# EAGLE schematic PIC_WIFI (EAGLE 6.2)
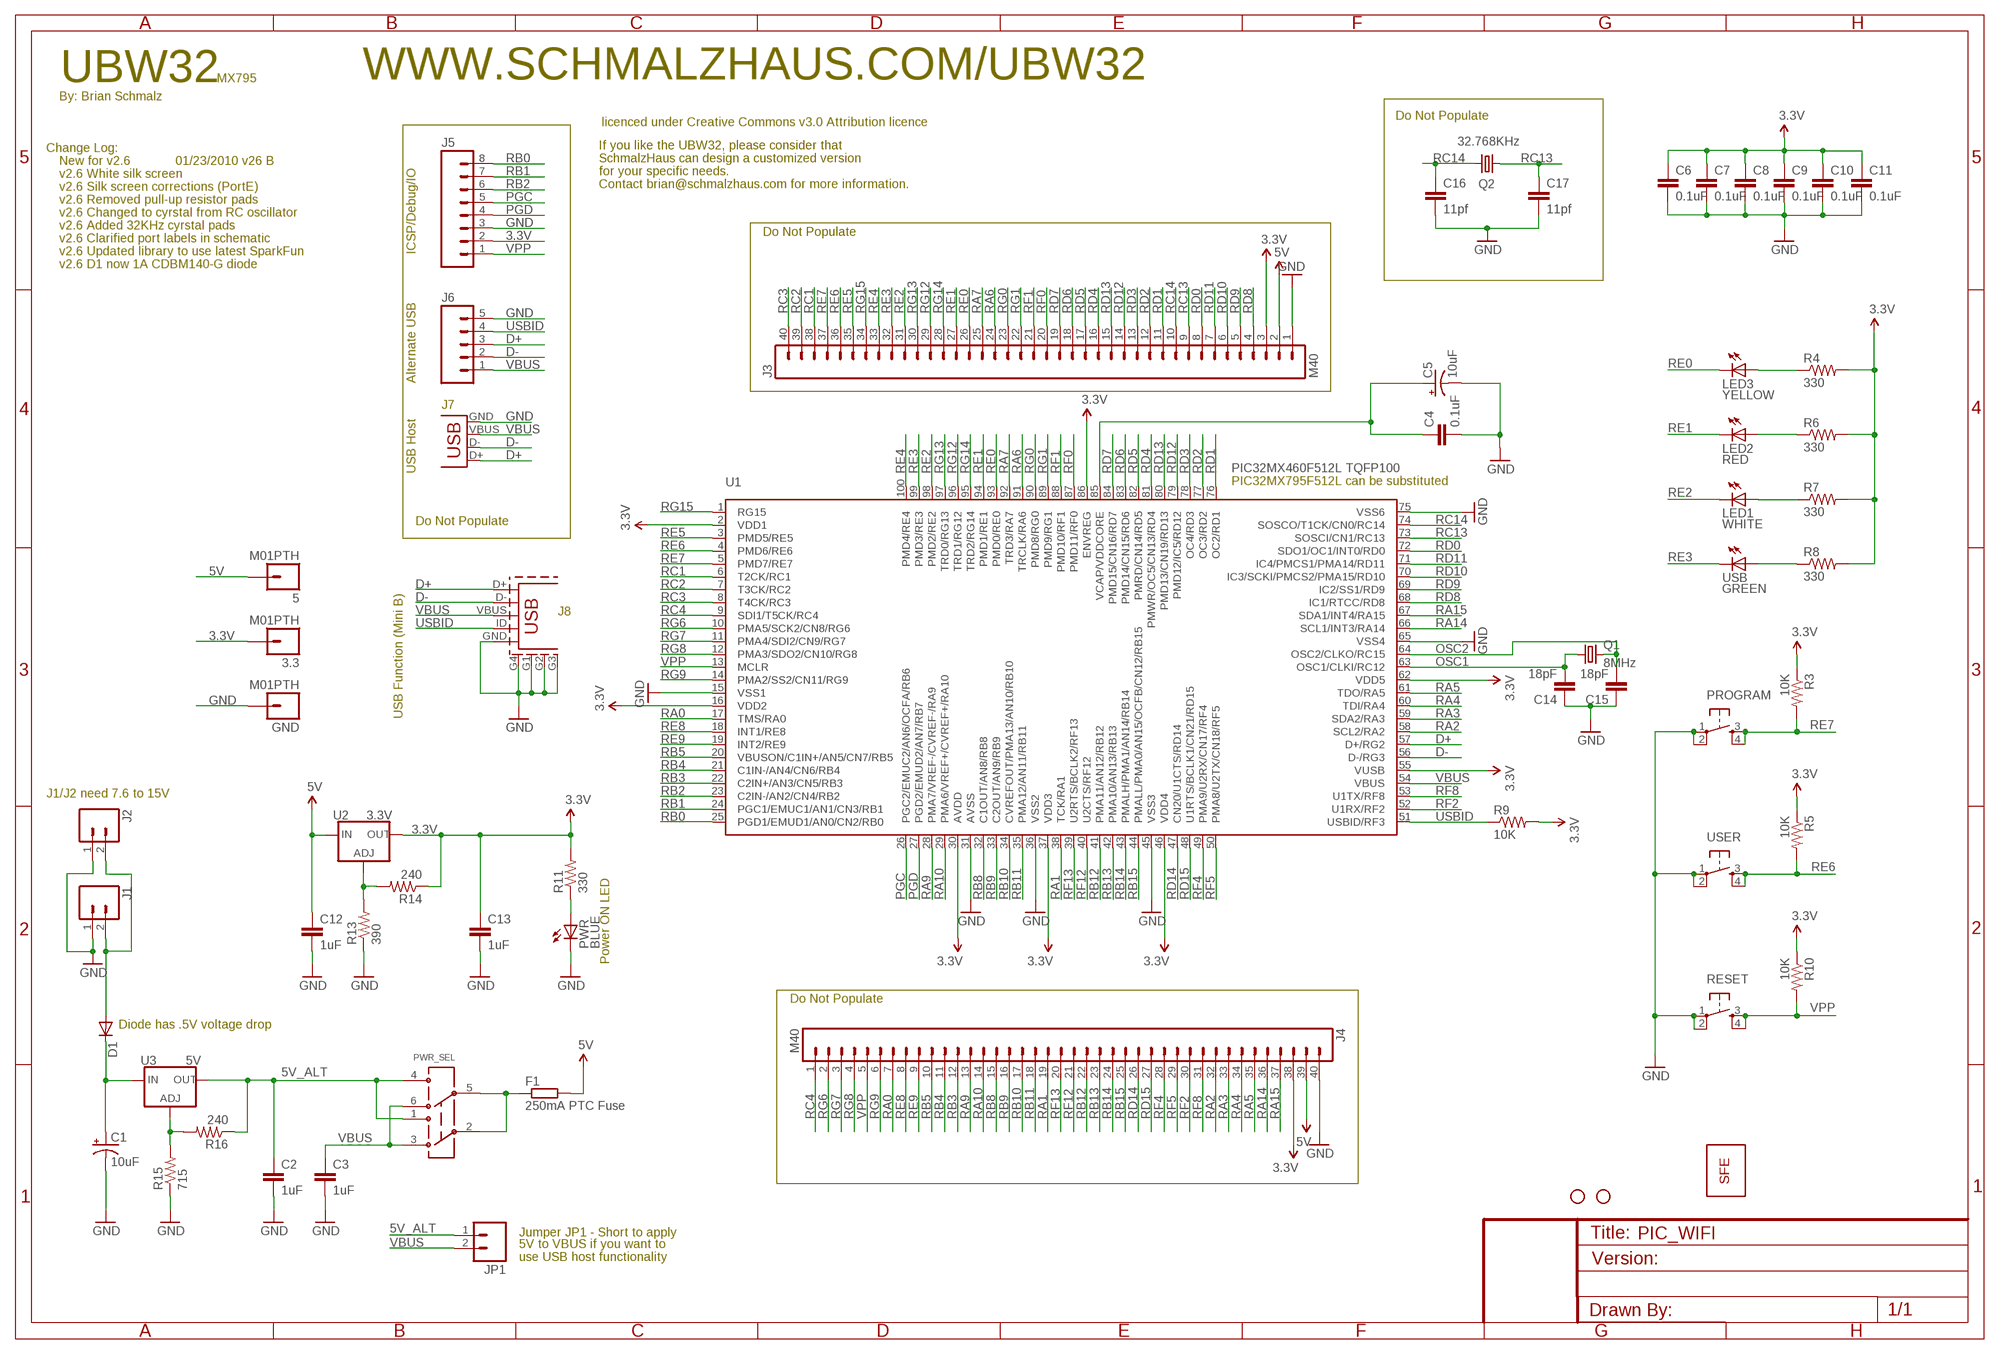
[diagram p0: schematic, sheet 1]

## Parts
3.3  M01PTH  [1X01]
5  M01PTH  [1X01]
C1  10uF  CAP_POL3528  [EIA3528]
C2  1uF  CAP0402  [C0402]
C3  1uF  CAP0402  [C0402]
C4  0.1uF  CAP0402  [C0402]
C5  10uF  CAP_POL3528  [EIA3528]
C6  0.1uF  CAP0402  [C0402]
C7  0.1uF  CAP0402  [C0402]
C8  0.1uF  CAP0402  [C0402]
C9  0.1uF  CAP0402  [C0402]
C10  0.1uF  CAP0402  [C0402]
C11  0.1uF  CAP0402  [C0402]
C12  1uF  CAP0402  [C0402]
C13  1uF  CAP0402  [C0402]
C14  18pF  CAP0402  [C0402]
C15  18pF  CAP0402  [C0402]
C16  11pf  CAP0402  [C0402]
C17  11pf  CAP0402  [C0402]
D1  DIODESMA  [SMA-DIODE]
F1  250mA PTC Fuse  R-EU_R1206  [R1206]
GND  M01PTH  [1X01]
J1  M02PTH  [1X02]
J2  M02-JST-2MM-SMT  [S2B-PH]
J3  M40  [1X40]
J4  M40  [1X40]
J5  M08  [1X08]
J6  M05PTH  [1X05]
J7  USB-A-S  [USB-A-S]
J8  USB_5PIN  [USB-MINIB]
JP1  M02PTH  [1X02]
LED1  WHITE  LED0603  [LED-0603]
LED2  RED  LED0603  [LED-0603]
LED3  YELLOW  LED0603  [LED-0603]
PROGRAM  TAC_SWITCHSND  [TACTILE_SWITCH_SMD]
PWR  BLUE  LED0603  [LED-0603]
PWR_SEL  AYZ0202  [AYZ0202]
Q1  8MHz  CRYSTAL5X3  [CRYSTAL-SMD-5X3]
Q2  32.768KHz  CRYSTAL32-SMD  [CRYSTAL-32KHZ-SMD]
R3  10K  RESISTOR0402  [C0402]
R4  330  RESISTOR0402  [C0402]
R5  10K  RESISTOR0402  [C0402]
R6  330  RESISTOR0402  [C0402]
R7  330  RESISTOR0402  [C0402]
R8  330  RESISTOR0402  [C0402]
R9  10K  RESISTOR0402  [C0402]
R10  10K  RESISTOR0402  [C0402]
R11  330  RESISTOR0402  [C0402]
R13  390  RESISTOR0402  [C0402]
R14  240  RESISTOR0402  [C0402]
R15  715  RESISTOR0402  [C0402]
R16  240  RESISTOR0402  [C0402]
RESET  TAC_SWITCHSND  [TACTILE_SWITCH_SMD]
U1  PIC32MX460F512L TQFP100  PIC32MX4XXLTQFP100  [TQFP100]
U2  3.3V  V_REG_317SMD  [SOT223]
U3  5V  V_REG_317SMD  [SOT223]
U$4  LOGO-SFENEW  [SFE-NEW-WEBLOGO]
U$6  STAND-OFF  [STAND-OFF]
U$7  STAND-OFF  [STAND-OFF]
USB  GREEN  LED0603  [LED-0603]
USER  TAC_SWITCHSND  [TACTILE_SWITCH_SMD]

## Nets
3.3V: 3.3.1 C6.1 C7.1 C8.1 C9.1 C10.1 C11.1 C13.1 J3.3 J4.38 J5.2 R3.1 R4.2 R5.1 R6.2 R7.2 R8.2 R9.2 R10.1 R11.2 R14.1 U1.2(VDD1) U1.16(VDD2) U1.30(AVDD) U1.37(VDD3) U1.46(VDD4) U1.55(VUSB) U1.62(VDD5) U1.86(ENVREG) U2.2(OUT)
5V: 5.1 C12.1 F1.2 J3.2 J4.39 U2.3(IN)
5V_ALT: C2.1 JP1.1 PWR_SEL.1 PWR_SEL.4 R16.1 U3.2(OUT)
D+: J6.3 J7.D+ J8.D+ U1.57(D+/RG2)
D-: J6.2 J7.D- J8.D- U1.56(D-/RG3)
GND: C1.C(-) C2.2 C3.2 C4.2 C5.C(-) C6.2 C7.2 C8.2 C9.2 C10.2 C11.2 C12.2 C13.2 C14.1 C15.1 C16.2 C17.2 GND.1 J1.1 J2.1 J3.1 J4.40 J5.3 J6.5 J7.GND J8.G1 J8.G2 J8.G3 J8.G4(SHIELD) J8.GND PROGRAM.1 PROGRAM.2 PWR.C R13.1 R15.1 RESET.1 RESET.2 U1.15(VSS1) U1.31(AVSS) U1.36(VSS2) U1.45(VSS3) U1.65(VSS4) U1.75(VSS6) USER.1 USER.2
N$1: D1.A J1.2 J2.2
N$2: F1.1 PWR_SEL.2 PWR_SEL.5
N$3: R13.2 R14.2 U2.1(ADJ)
N$4: R15.2 R16.2 U3.1(ADJ)
N$6: PWR.A R11.1
N$20: R8.1 USB.A
N$22: LED1.A R7.1
N$23: LED2.A R6.1
N$35: LED3.A R4.1
N$110: C4.1 C5.A(+) U1.85(VCAP/VDDCORE)
OSC1: C14.2 Q1.1 U1.63(OSC1/CLKI/RC12)
OSC2: C15.2 Q1.3 U1.64(OSC2/CLKO/RC15)
PGC: J5.5 U1.26(PGC2/EMUC2/AN6/OCFA/RB6)
PGD: J5.4 U1.27(PGD2/EMUD2/AN7/RB7)
RA0: J4.7 U1.17(TMS/RA0)
RA1: J4.19 U1.38(TCK/RA1)
RA2: J4.32 U1.58(SCL2/RA2)
RA3: J4.33 U1.59(SDA2/RA3)
RA4: J4.34 U1.60(TDI/RA4)
RA5: J4.35 U1.61(TDO/RA5)
RA6: J3.24 U1.91(TRCLK/RA6)
RA7: J3.25 U1.92(TRD3/RA7)
RA9: J4.13 U1.28(PMA7/VREF-/CVREF-/RA9)
RA10: J4.14 U1.29(PMA6/VREF+/CVREF+/RA10)
RA14: J4.36 U1.66(SCL1/INT3/RA14)
RA15: J4.37 U1.67(SDA1/INT4/RA15)
RB0: J5.8 U1.25(PGD1/EMUD1/AN0/CN2/RB0)
RB1: J5.7 U1.24(PGC1/EMUC1/AN1/CN3/RB1)
RB2: J5.6 U1.23(C2IN-/AN2/CN4/RB2)
RB3: J4.12 U1.22(C2IN+/AN3/CN5/RB3)
RB4: J4.11 U1.21(C1IN-/AN4/CN6/RB4)
RB5: J4.10 U1.20(VBUSON/C1IN+/AN5/CN7/RB5)
RB8: J4.15 U1.32(C1OUT/AN8/RB8)
RB9: J4.16 U1.33(C2OUT/AN9/RB9)
RB10: J4.17 U1.34(CVREFOUT/PMA13/AN10/RB10)
RB11: J4.18 U1.35(PMA12/AN11/RB11)
RB12: J4.22 U1.41(PMA11/AN12/RB12)
RB13: J4.23 U1.42(PMA10/AN13/RB13)
RB14: J4.24 U1.43(PMALH/PMA1/AN14/RB14)
RB15: J4.25 U1.44(PMALL/PMA0/AN15/OCFB/CN12/RB15)
RC1: J3.38 U1.6(T2CK/RC1)
RC2: J3.39 U1.7(T3CK/RC2)
RC3: J3.40 U1.8(T4CK/RC3)
RC4: J4.1 U1.9(SDI1/T5CK/RC4)
RC13: C17.1 J3.9 Q2.X1 U1.73(SOSCI/CN1/RC13)
RC14: C16.1 J3.10 Q2.X2 U1.74(SOSCO/T1CK/CN0/RC14)
RD0: J3.8 U1.72(SDO1/OC1/INT0/RD0)
RD1: J3.11 U1.76(OC2/RD1)
RD2: J3.12 U1.77(OC3/RD2)
RD3: J3.13 U1.78(OC4/RD3)
RD4: J3.16 U1.81(PMWR/OC5/CN13/RD4)
RD5: J3.17 U1.82(PMRD/CN14/RD5)
RD6: J3.18 U1.83(PMD14/CN15/RD6)
RD7: J3.19 U1.84(PMD15/CN16/RD7)
RD8: J3.4 U1.68(IC1/RTCC/RD8)
RD9: J3.5 U1.69(IC2/SS1/RD9)
RD10: J3.6 U1.70(IC3/SCKI/PMCS2/PMA15/RD10)
RD11: J3.7 U1.71(IC4/PMCS1/PMA14/RD11)
RD12: J3.14 U1.79(PMD12/IC5/RD12)
RD13: J3.15 U1.80(PMD13/CN19/RD13)
RD14: J4.26 U1.47(CN20/U1CTS/RD14)
RD15: J4.27 U1.48(U1RTS/BCLK1/CN21/RD15)
RE0: J3.26 LED3.C U1.93(PMD0/RE0)
RE1: J3.27 LED2.C U1.94(PMD1/RE1)
RE2: J3.31 LED1.C U1.98(PMD2/RE2)
RE3: J3.32 U1.99(PMD3/RE3) USB.C
RE4: J3.33 U1.100(PMD4/RE4)
RE5: J3.35 U1.3(PMD5/RE5)
RE6: J3.36 R5.2 U1.4(PMD6/RE6) USER.3 USER.4
RE7: J3.37 PROGRAM.3 PROGRAM.4 R3.2 U1.5(PMD7/RE7)
RE8: J4.8 U1.18(INT1/RE8)
RE9: J4.9 U1.19(INT2/RE9)
RF0: J3.20 U1.87(PMD11/RF0)
RF1: J3.21 U1.88(PMD10/RF1)
RF2: J4.30 U1.52(U1RX/RF2)
RF4: J4.28 U1.49(PMA9/U2RX/CN17/RF4)
RF5: J4.29 U1.50(PMA8/U2TX/CN18/RF5)
RF8: J4.31 U1.53(U1TX/RF8)
RF12: J4.21 U1.40(U2CTS/RF12)
RF13: J4.20 U1.39(U2RTS/BCLK2/RF13)
RG0: J3.23 U1.90(PMD8/RG0)
RG1: J3.22 U1.89(PMD9/RG1)
RG6: J4.2 U1.10(PMA5/SCK2/CN8/RG6)
RG7: J4.3 U1.11(PMA4/SDI2/CN9/RG7)
RG8: J4.4 U1.12(PMA3/SDO2/CN10/RG8)
RG9: J4.6 U1.14(PMA2/SS2/CN11/RG9)
RG12: J3.29 U1.96(TRD1/RG12)
RG13: J3.30 U1.97(TRD0/RG13)
RG14: J3.28 U1.95(TRD2/RG14)
RG15: J3.34 U1.1(RG15)
USBID: J6.4 J8.ID(USB_ID) R9.1 U1.51(USBID/RF3)
VBUS: C3.1 J6.1 J7.VBUS J8.VBUS JP1.2 PWR_SEL.3 PWR_SEL.6 U1.54(VBUS)
VIN_RAW: C1.A(+) D1.C U3.3(IN)
VPP: J4.5 J5.1 R10.2 RESET.3 RESET.4 U1.13(MCLR)

## Notes on the sheet
- UBW32 | MX795 | WWW.SCHMALZHAUS.COM/UBW32
- By: Brian Schmalz
- Do Not Populate
- licenced under Creative Commons v3.0 Attribution licence
- Change Log: | If you like the UBW32, please consider that
- New for v2.6 | 01/23/2010 v26 B | SchmalzHaus can design a customized version
- v2.6 White silk screen | for your specific needs.
- v2.6 Silk screen corrections (PortE) | Contact brian@schmalzhaus.com for more information.
- v2.6 Removed pull-up resistor pads
- v2.6 Changed to cyrstal from RC oscillator
- v2.6 Added 32KHz cyrstal pads
- Do Not Populate
- v2.6 Clarified port labels in schematic
- v2.6 Updated library to use latest SparkFun | ICSP/Debug/IO
- v2.6 D1 now 1A CDBM140-G diode
- Alternate USB
- J7
- USB Host
- PIC32MX795F512L can be substituted
- Do Not Populate
- J8
- USB Function (Mini B)
- J1/J2 need 7.6 to 15V
- Power ON LED
- Do Not Populate
- Diode has .5V voltage drop
- Jumper JP1 - Short to apply
- 5V to VBUS if you want to
- use USB host functionality

## Library data of the parts
3.3 5 GND = SparkFun-12-01-09:M01: Header 1 Standard 1-pin 0.1" header. Use with straight break away headers (SKU : PRT-00116), right angle break away headers (PRT-00553), swiss pins (PRT-00743), machine pins (PRT-00117), and female headers (PRT-00115).
C1 C5 = SparkFun02-20-08:CAP_POL: Capacitor Polarized These are standard SMD and PTH capacitors. Normally 10uF, 47uF, and 100uF in electrolytic and tantalum varieties. Always verify the external diameter of the through hole cap, it varies with capacity, voltage, and manufacturer. The EIA devices should be standard.
C2-C4 C6-C9 C11 C14-C17 = SparkFun:CAP: Capacitor Standard 0603 ceramic capacitor, and 0.1" leaded capacitor.
C10 C12 C13 = SparkFun02-20-08:CAP: Capacitor Standard 0603 ceramic capacitor, and 0.1" leaded capacitor.
D1 = SparkFun-12-01-09:DIODE: Diode These are standard reverse protection diodes and small signal diodes. SMA package can handle up to about 1A. SOD-323 can handle about 200mA. What the SOD-323 package when ordering, there are some mfgs out there that are 5-pin packages.
F1 = resistor:R-EU_: RESISTOR, European symbol
J1 JP1 = SparkFun-12-01-09:M02: Header 2 Standard 2-pin 0.1" header. Use with straight break away headers (SKU : PRT-00116), right angle break away headers (PRT-00553), swiss pins (PRT-00743), machine pins (PRT-00117), and female headers (PRT-00115). Molex polarized connector foot print use with SKU : PRT-08233 with associated crimp pins and housings.
J2 = SparkFun:M02: Header 2 Standard 2-pin 0.1" header. Use with straight break away headers (SKU : PRT-00116), right angle break away headers (PRT-00553), swiss pins (PRT-00743), machine pins (PRT-00117), and female headers (PRT-00115). Molex polarized connector foot print use with SKU : PRT-08233 with associated crimp pins and housings.
J3 J4 = SchmalzHaus:M40
J5 = SchmalzHaus:M08: Header 8 Standard 8-pin 0.1" header. Use with straight break away headers (SKU : PRT-00116), right angle break away headers (PRT-00553), swiss pins (PRT-00743), machine pins (PRT-00117), and female headers (PRT-00115).
J6 = SparkFun-12-01-09:M05: Header 5 Standard 5-pin 0.1" header. Use with straight break away headers (SKU : PRT-00116), right angle break away headers (PRT-00553), swiss pins (PRT-00743), machine pins (PRT-00117), and female headers (PRT-00115). Molex polarized connector foot print use with SKU : PRT-08230 with associated crimp pins and housings.
J7 = SparkFun02-20-08:USB: USB Connectors USB-B-PTH is fully proven SKU : PRT-00139 USB-miniB is fully proven SKU : PRT-00587 USB-A-PCB is untested. USB-A-H is throughly reviewed, but untested. Spark Fun Electronics SKU : PRT-00437 USB-B-SMT is throughly reviewed, but untested. Needs silkscreen touching up. USB-A-S has not been used/tested USB-MB-H has not been used/tested
J8 = SparkFun02-20-08:USB_5PIN
LED1-LED3 PWR USB = SparkFun:LED: LEDs Standard schematic elements and footprints for 5mm, 3mm, 1206, and 0603 sized LEDs. 5mm - Spark Fun Electronics SKU : COM-00529 (and others)
PROGRAM RESET USER = SparkFun02-20-08:TAC_SWITCH: Momentary Switch Button commonly used for reset or general input. Spark Fun Electronics SKU : COM-00097
PWR_SEL = SparkFun02-20-08:AYZ0202: SPDT Slide Switch Simple SMD single-pull double-throw slide switch. Good for less than 350mA power switch, switching UARTs between devices, etc. Spark Fun Electronics SKU : COM-00597
Q1 = SparkFun11_03_09:CRYSTAL: Crystals Various standard crystals. Proven footprints. Spark Fun Electronics SKU : COM-00534
Q2 = SchmalzHaus:CRYSTAL: Crystals Various standard crystals. Proven footprints. Spark Fun Electronics SKU : COM-00534
R3-R11 R13-R16 = SparkFun:RESISTOR: Resistor Basic schematic elements and footprints for 0603, 1206, and PTH 1/10th watt (small) resistors.
U1 = SchmalzHaus:PIC32MX4XXL
U2 U3 = SparkFun:V_REG_317: Voltage Regulator Standard LM317 adjustable voltage regulator. AOI (Adjust Output Input). Google 'LM317 Calculator' for easy to use app to get the two resistor values needed. 240/720 for 5V output. 240/390 for 3.3V output. Spark Fun Electronics SKU : COM-00527
U$4 = SparkFun02-20-08:LOGO-SFE: Spark Fun Electronics PCB Logo This is the standard Spark Fun Electronics PCB logo.
U$6 U$7 = SparkFun02-20-08:STAND-OFF: Stand Off This is the mechanical footprint for a #4 phillips button head screw. Use the keepout ring to avoid running the screw head into surrounding components. SKU : PRT-00447